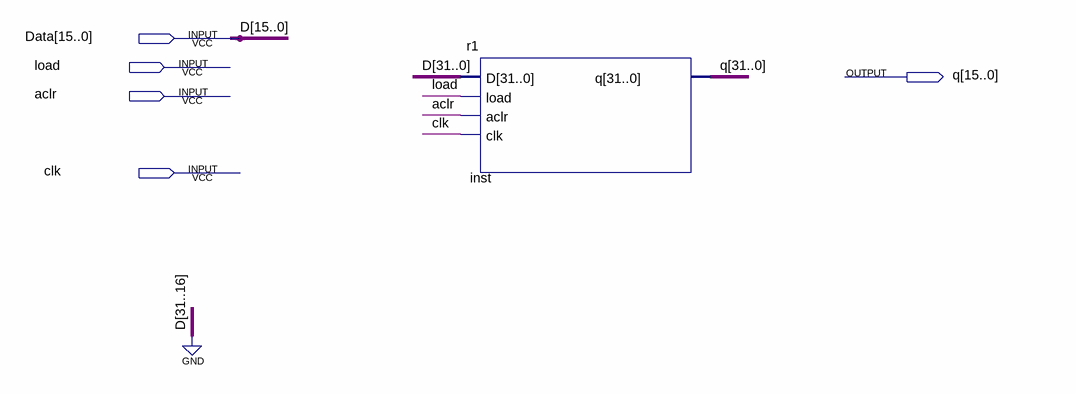
[diagram p0: schematic sheet]
// Quartus schematic r1_16bit.bdf as structural Verilog: 1 symbols, 5 pins
module r1_16bit (
  input  [15:0] Data,
  input  load,
  input  aclr,
  input  clk,
  output [31:0] q
);

  r1 inst (.D({{16{1'b0}}, Data}), .load(load), .aclr(aclr), .clk(clk), .q(q));

  // Other names for the same wires on the sheet: D[15:0] = Data
endmodule
